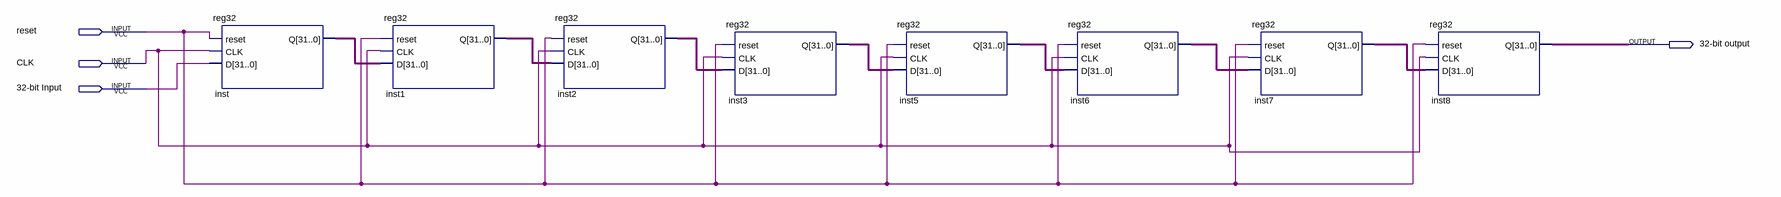
[diagram p0: schematic sheet]
// Quartus schematic 8_32bit_regs.bdf as structural Verilog: 8 symbols, 4 pins
module \8_32bit_regs  (
  input  reset,
  input  CLK,
  input  \32-bit_Input ,
  output \32-bit_output 
);

  wire [31:0] inst1_q, inst2_q, inst3_q, inst5_q, inst6_q, inst7_q, inst8_q, inst_q;

  reg32 inst (.reset(reset), .CLK(CLK), .D({32{\32-bit_Input }}), .Q(inst_q));
  reg32 inst1 (.reset(reset), .CLK(CLK), .D(inst_q), .Q(inst1_q));
  reg32 inst2 (.reset(reset), .CLK(CLK), .D(inst1_q), .Q(inst2_q));
  reg32 inst3 (.reset(reset), .CLK(CLK), .D(inst2_q), .Q(inst3_q));
  reg32 inst5 (.reset(reset), .CLK(CLK), .D(inst3_q), .Q(inst5_q));
  reg32 inst6 (.reset(reset), .CLK(CLK), .D(inst5_q), .Q(inst6_q));
  reg32 inst7 (.reset(reset), .CLK(CLK), .D(inst6_q), .Q(inst7_q));
  reg32 inst8 (.reset(reset), .CLK(CLK), .D(inst7_q), .Q(inst8_q));
endmodule
